# Altium schematic sheet iMX6 Rex Development Baseboard V1I1 Project.SchDoc
size A3; CompanyName: FEDEVEL; Organization: FEDEVEL; DocumentNumber: 20; Revision: V1I1; SheetNumber: 20; SheetTotal: 20; PageSetup: Record=PageOptions|CenterHorizontal=True|CenterVertical=True|PrintScale=1.07|XCorrection=1.00|YCorrection=1.00|PrintKind=1|BorderSize=5000000|LeftOffset=0|BottomOffset=0|Orientation=2|PaperLength=1000|PaperWidth=1000|Scale=100|PaperSource=7|PrintQuality=600|MediaType=1|DitherType=10|PaperKind=A3|PrintScaleMode=1; ProjectName: KDS C6A816x Module
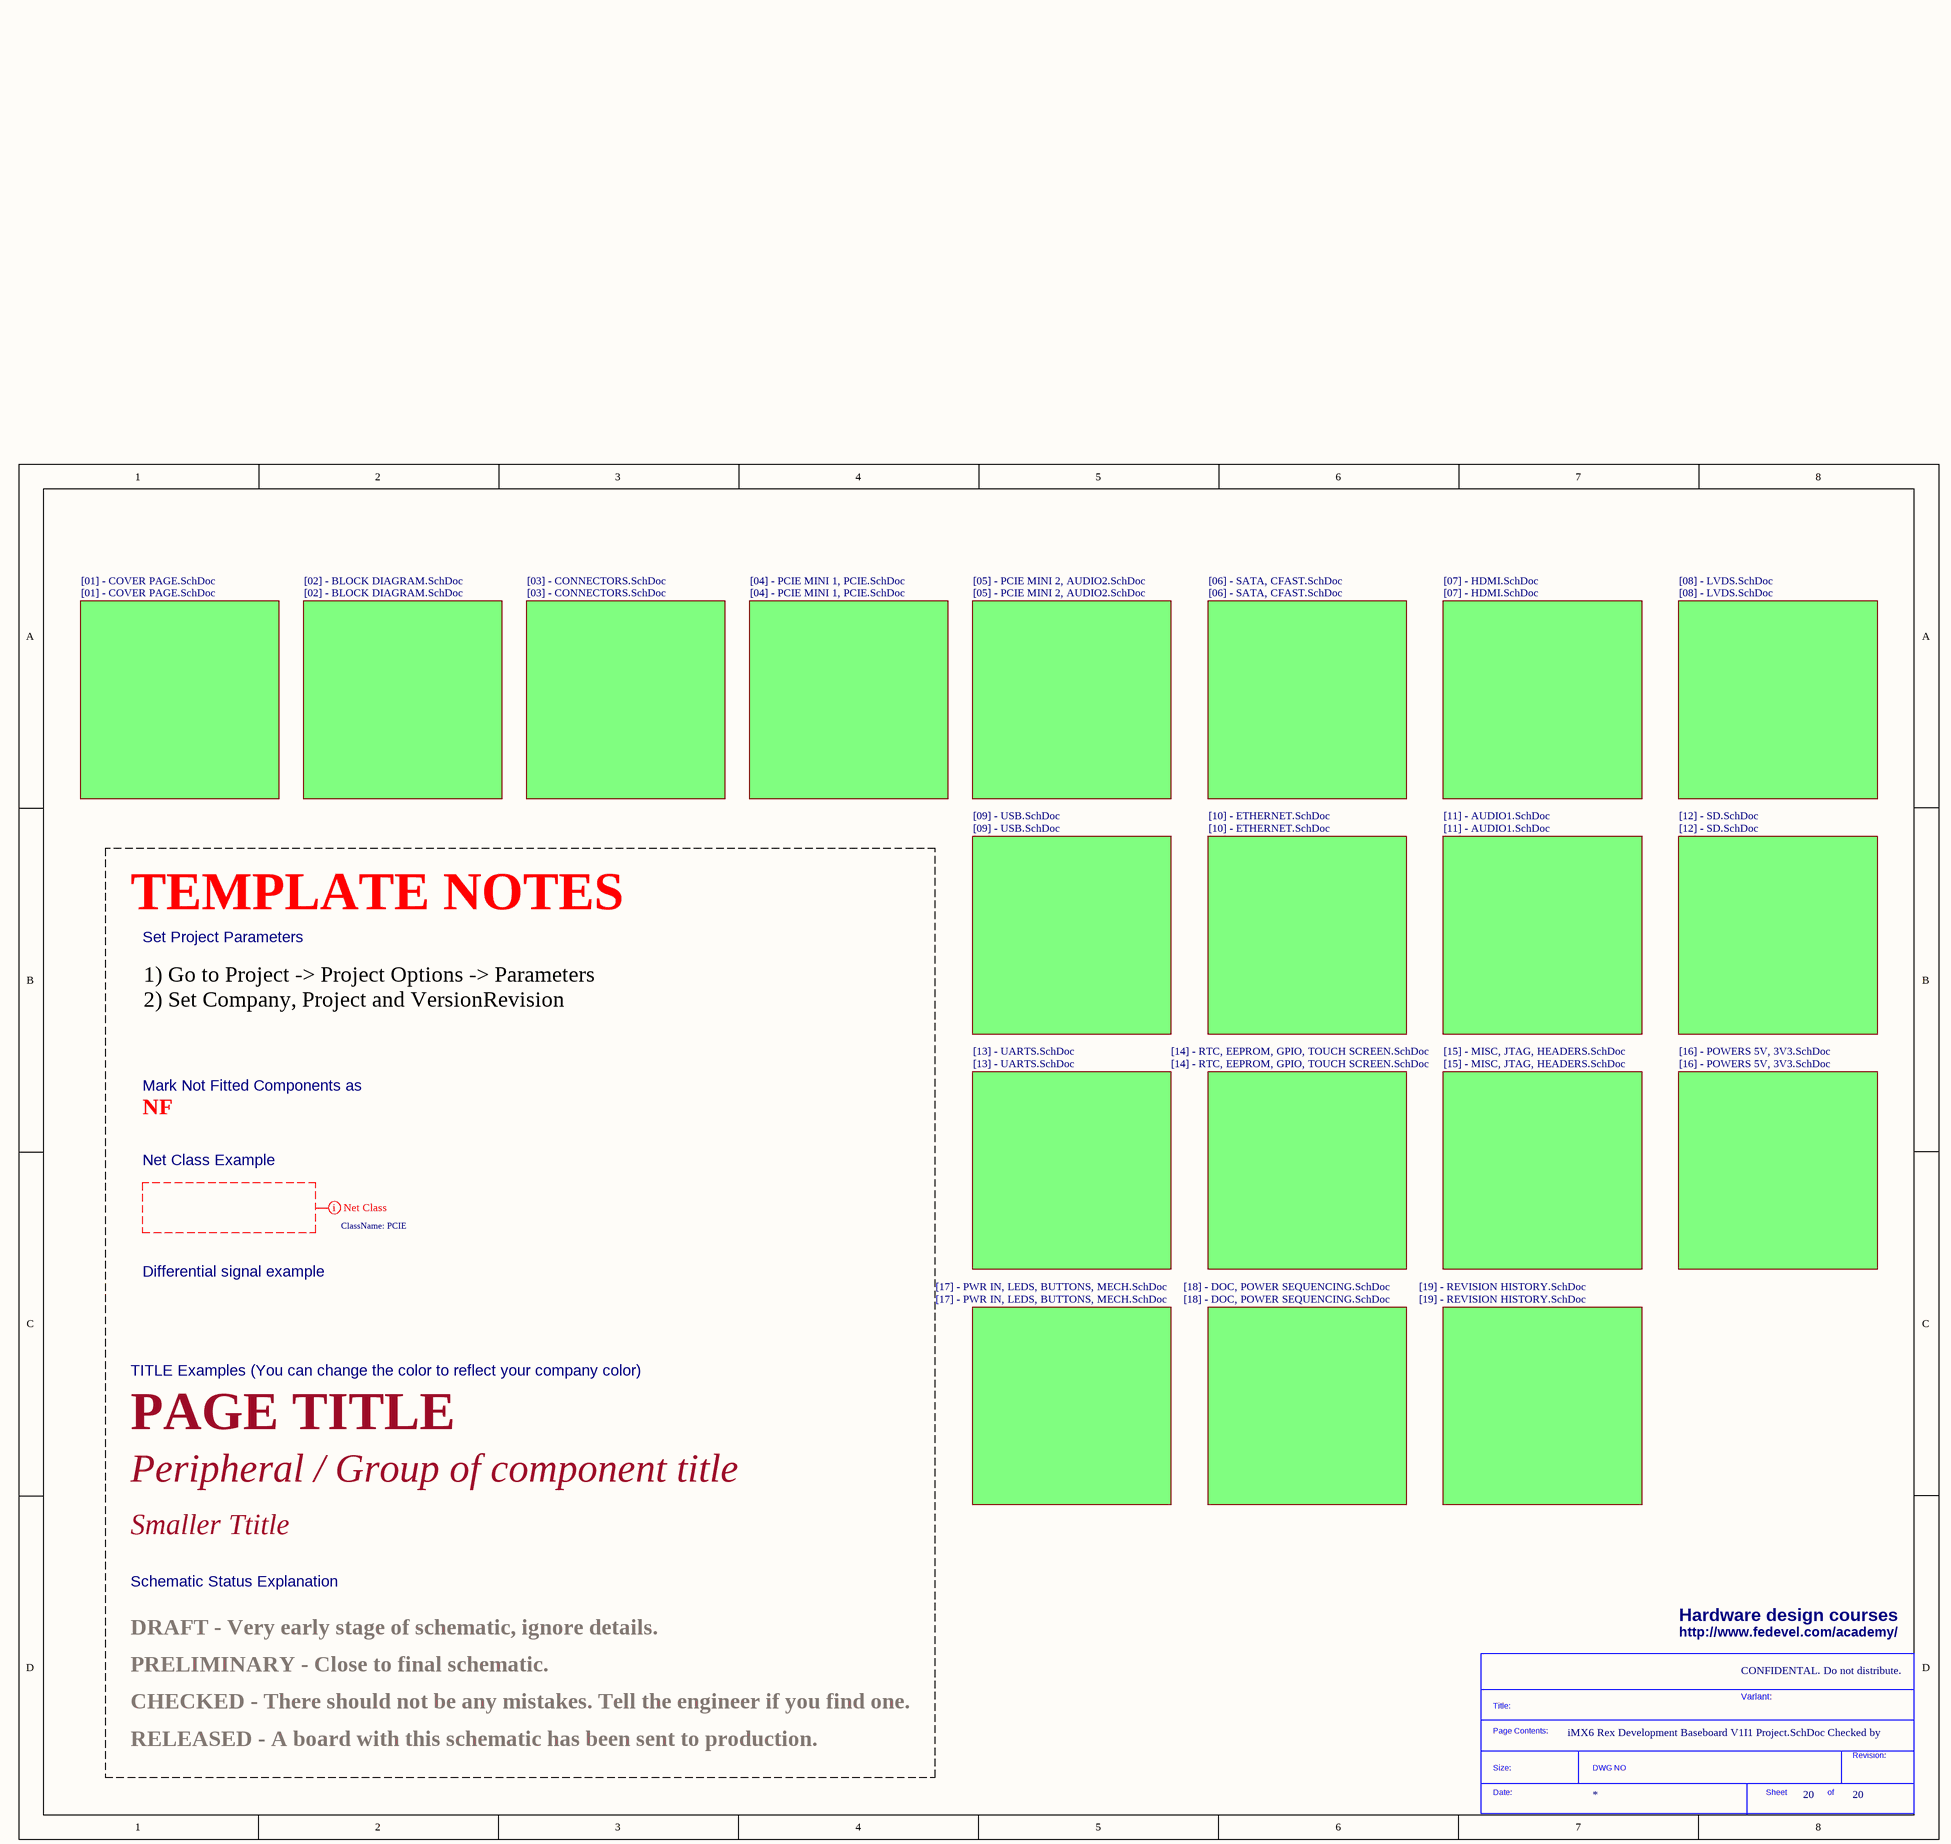
[diagram p0: iMX6 Rex Development Baseboard V1I1 Project.SchDoc]

## Parts
*  SDTitleBlock  (value not drawn)  (graphical)

## Sub-sheets
[01] - COVER PAGE.SchDoc = [01] - COVER PAGE.SchDoc: no entries
[02] - BLOCK DIAGRAM.SchDoc = [02] - BLOCK DIAGRAM.SchDoc: no entries
[03] - CONNECTORS.SchDoc = [03] - CONNECTORS.SchDoc: no entries
[04] - PCIE MINI 1, PCIE.SchDoc = [04] - PCIE MINI 1, PCIE.SchDoc: no entries
[05] - PCIE MINI 2, AUDIO2.SchDoc = [05] - PCIE MINI 2, AUDIO2.SchDoc: no entries
[06] - SATA, CFAST.SchDoc = [06] - SATA, CFAST.SchDoc: no entries
[07] - HDMI.SchDoc = [07] - HDMI.SchDoc: no entries
[08] - LVDS.SchDoc = [08] - LVDS.SchDoc: no entries
[09] - USB.SchDoc = [09] - USB.SchDoc: no entries
[10] - ETHERNET.SchDoc = [10] - ETHERNET.SchDoc: no entries
[11] - AUDIO1.SchDoc = [11] - AUDIO1.SchDoc: no entries
[12] - SD.SchDoc = [12] - SD.SchDoc: no entries
[13] - UARTS.SchDoc = [13] - UARTS.SchDoc: no entries
[14] - RTC, EEPROM, GPIO, TOUCH SCREEN.SchDoc = [14] - RTC, EEPROM, GPIO, TOUCH SCREEN.SchDoc: no entries
[15] - MISC, JTAG, HEADERS.SchDoc = [15] - MISC, JTAG, HEADERS.SchDoc: no entries
[16] - POWERS 5V, 3V3.SchDoc = [16] - POWERS 5V, 3V3.SchDoc: no entries
[17] - PWR IN, LEDS, BUTTONS, MECH.SchDoc = [17] - PWR IN, LEDS, BUTTONS, MECH.SchDoc: no entries
[18] - DOC, POWER SEQUENCING.SchDoc = [18] - DOC, POWER SEQUENCING.SchDoc: no entries
[19] - REVISION HISTORY.SchDoc = [19] - REVISION HISTORY.SchDoc: no entries

## Layout directives
net class PCIE: (no net found under the mark)

## Notes on the sheet
- TEMPLATE NOTES
- Set Project Parameters
- 1) Go to Project -> Project Options -> Parameters
  2) Set Company, Project and VersionRevision
- NF
- Mark Not Fitted Components as
- Net Class Example
- Differential signal example
- TITLE Examples (You can change the color to reflect your company color)
- PAGE TITLE
- Peripheral / Group of component title
- Smaller Ttitle
- Schematic Status Explanation
- Hardware design courses
- PRELIMINARY - Close to final schematic.
- DRAFT - Very early stage of schematic, ignore details.
- http://www.fedevel.com/academy/
- CONFIDENTAL. Do not distribute.
- CHECKED - There should not be any mistakes. Tell the engineer if you find one.
- Variant:
- Checked by
- RELEASED - A board with this schematic has been sent to production.
- (in symbol SDTitleBlock) Title:; Page Contents:; Revision:; Size:; DWG NO; Date:; Sheet; of